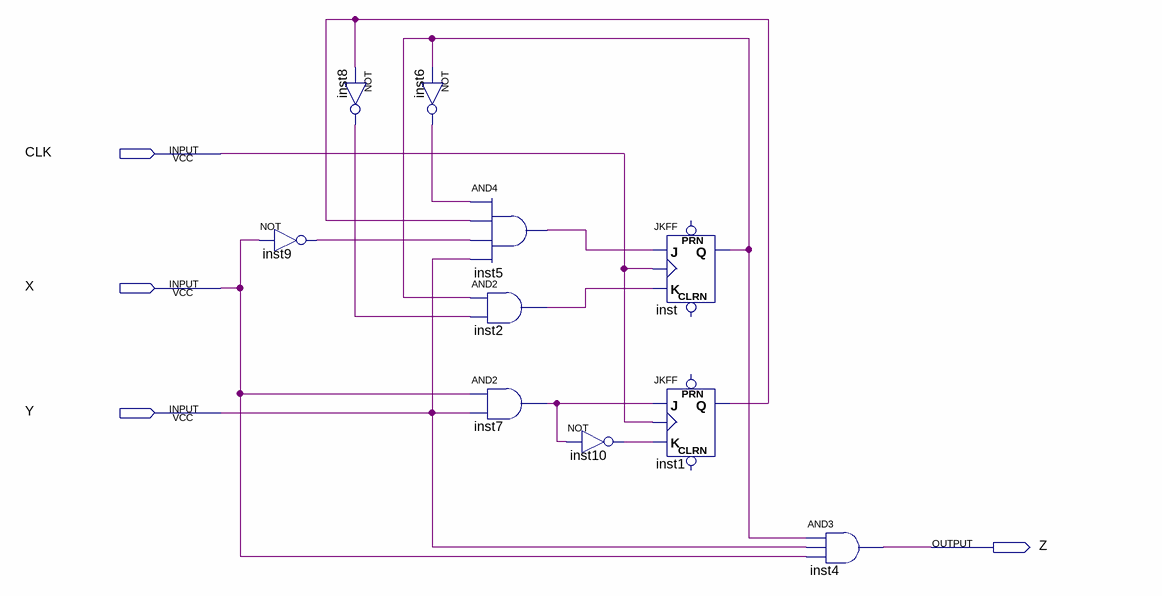
[diagram p0: schematic sheet]
// Quartus schematic Problema53.bdf as structural Verilog: 10 symbols, 4 pins
module Problema53 (
  input  CLK,
  input  X,
  input  Y,
  output Z
);

  wire inst1_q, inst2_out, inst5_out, inst6_out, inst7_out, inst8_out, inst9_out, inst10_out, inst_q;

  not inst9 (inst9_out, X);
  not inst8 (inst8_out, inst1_q);
  not inst6 (inst6_out, inst_q);
  and inst5 (inst5_out, inst6_out, inst1_q, inst9_out, Y);
  and inst2 (inst2_out, inst_q, inst8_out);
  and inst7 (inst7_out, X, Y);
  not inst10 (inst10_out, inst7_out);
  JKFF inst (.K(inst2_out), .J(inst5_out), .CLK(CLK), .Q(inst_q));  // open: PRN, CLRN
  JKFF inst1 (.K(inst10_out), .J(inst7_out), .CLK(CLK), .Q(inst1_q));  // open: PRN, CLRN
  and inst4 (Z, inst_q, Y, X);
endmodule
